# Altium schematic sheet IAQ_Schematic.schdoc
size 278 x 212 mm
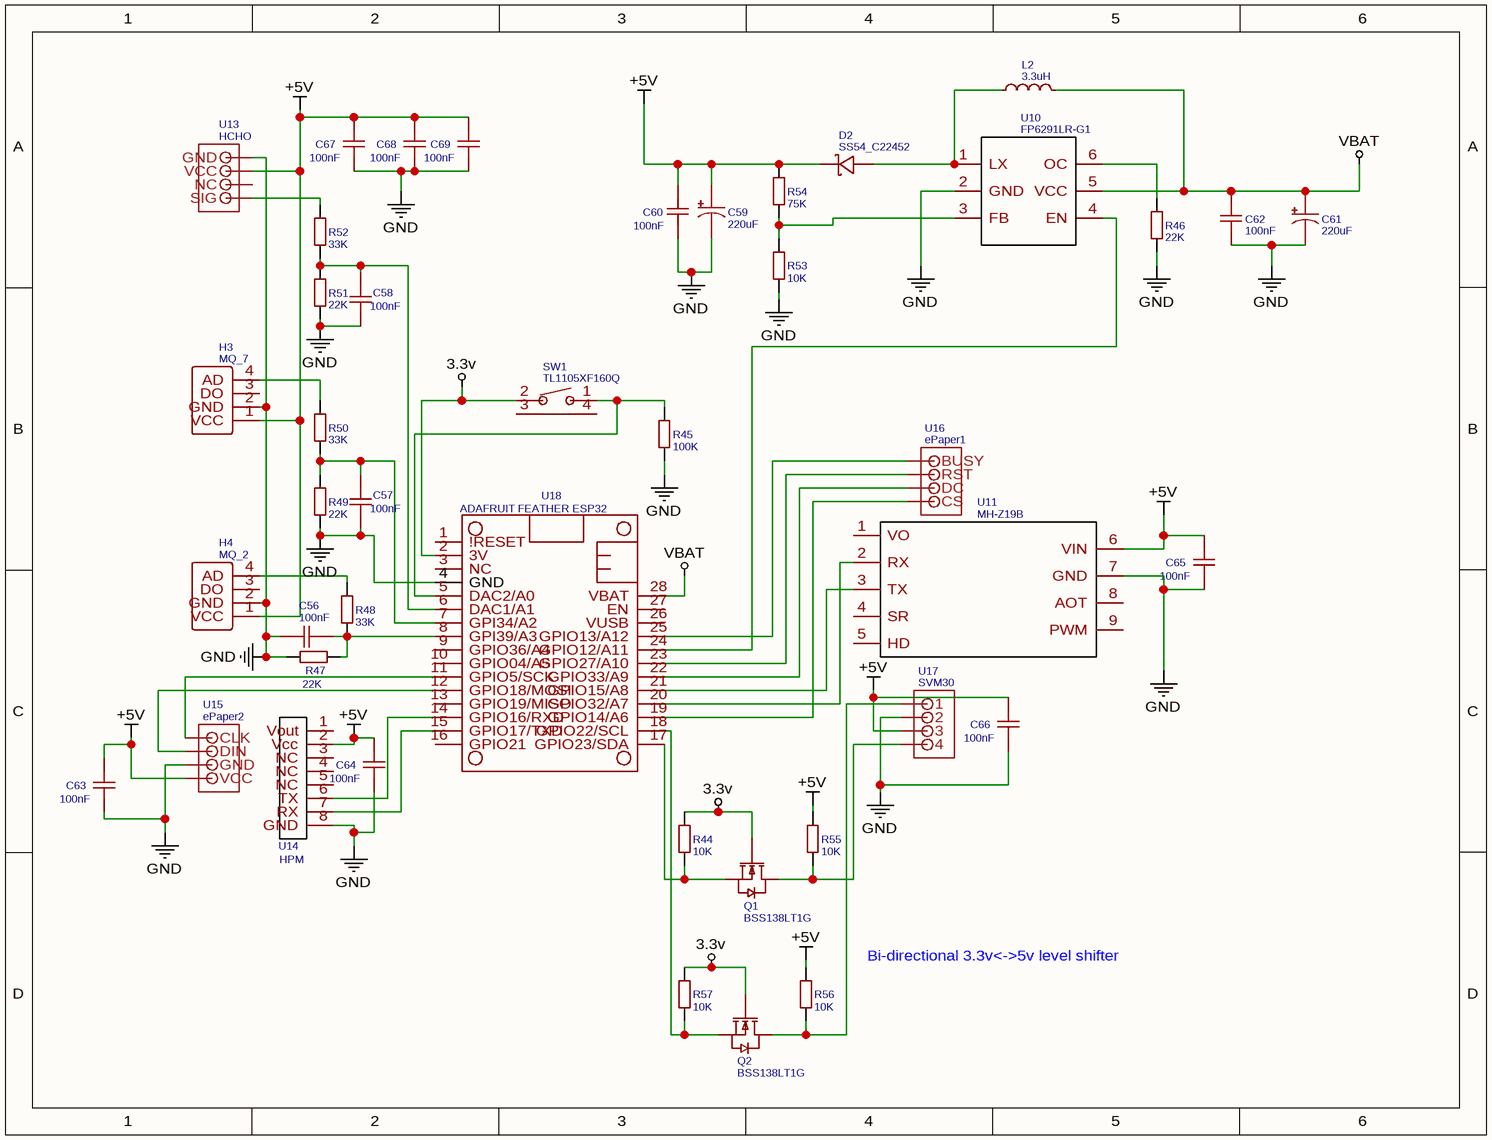
[diagram p0: IAQ_Schematic.schdoc]

## Parts
C56  100nF  [C0603]
C57  100nF  [C0603]
C58  100nF  [C0603]
C59  220uF  [CAP-SMD_BD10.0-L10.3-W10.3-FD]
C60  100nF  [C0603]
C61  220uF  [CAP-SMD_BD10.0-L10.3-W10.3-FD]
C62  100nF  [C0603]
C63  100nF  [C0603]
C64  100nF  [C0603]
C65  100nF  [C0603]
C66  100nF  [C0603]
C67  100nF  [C0603]
C68  100nF  [C0603]
C69  100nF  [C0603]
D2  SS54_C22452  [SMA_L4.3-W2.6-LS5.2-FD]
H3  MQ_7  [DIP-1X4P2.54]
H4  MQ_2  [DIP-1X4P2.54]
L2  3.3uH  [IND-SMD_L10.0-W9.0]
Q1  BSS138LT1G  [SOT-23-3_L2.9-W1.6-P1.90-LS2.8-BR]
Q2  BSS138LT1G  [SOT-23-3_L2.9-W1.6-P1.90-LS2.8-BR]
R44  10K  [R0603]
R45  100K  [R0603]
R46  22K  [R0603]
R47  22K  [R0603]
R48  33K  [R0603]
R49  22K  [R0603]
R50  33K  [R0603]
R51  22K  [R0603]
R52  33K  [R0603]
R53  10K  [R0603]
R54  75K  [R0603]
R55  10K  [R0603]
R56  10K  [R0603]
R57  10K  [R0603]
SW1  TL1105XF160Q  [KEY-TH_TL1105XF160Q]
U10  FP6291LR-G1  [SOT-23-6_L2.9-W1.6-P0.95-LS2.8-BL]
U11  MH-Z19B  [MH-Z19BCOR]
U13  HCHO  [JST_B4B-PH_HEADER]
U14  HPM  [1X8 1.25MM]
U15  ePaper2  [JST_B4B-PH_HEADER]
U16  ePaper1  [JST_B4B-PH_HEADER]
U17  SVM30  [JST_B4B-PH_HEADER]
U18  ADAFRUIT FEATHER ESP32  [ADAFRUIT FEATHER ESP32]

## Nets
3.3v: Q1.1(G) Q2.1(G) R44.2 R57.2 SW1.2 U18.2(3V)
+5V: C59.1 C60.2 C63.2 C64.2 C65.2 C66.2 C67.2 C68.2 C69.2 D2.2(K) H3.1(VCC) H4.1(VCC) R54.2 R55.2 R56.2 U11.6(VIN) U13.P3(VCC) U14.2(Vcc) U15.P4(VCC) U17.P3(3)
GND: C56.1 C57.1 C58.1 C59.2 C60.1 C61.2 C62.1 C63.1 C64.1 C65.1 C66.1 C67.1 C68.1 C69.1 H3.2(GND) H4.2(GND) R45.1 R46.1 R47.2 R49.1 R51.1 R53.1 U10.2(GND) U11.7(GND) U13.P4(GND) U14.8(GND) U15.P3(GND) U17.P2(2) U18.4(GND)
VBAT: C61.1 C62.2 L2.2 U10.5(VCC) U18.28(VBAT)
NetC56_2: C56.2 R47.1 R48.1 U18.8(GPI39/A3)
NetC57_2: C57.2 R49.2 R50.1 U18.7(GPI34/A2)
NetC58_2: C58.2 R51.2 R52.1 U18.6(DAC1/A1)
NetD2_1: D2.1(A) L2.1 U10.1(LX)
NetH3_4: H3.4(AD) R50.2
NetH4_4: H4.4(AD) R48.2
NetQ1_2: Q1.2(S) R44.1 U18.17(GPIO23/SDA)
NetQ1_3: Q1.3(D) R55.1 U17.P4(4)
NetQ2_2: Q2.2(S) R57.1 U18.18(GPIO22/SCL)
NetQ2_3: Q2.3(D) R56.1 U17.P1(1)
NetR45_2: R45.2 SW1.1 U18.5(DAC2/A0)
NetR46_2: R46.2 U10.6(OC)
NetR52_2: R52.2 U13.P1(SIG)
NetR53_2: R53.2 R54.1 U10.3(FB)
NetU10_4: U10.4(EN) U18.24(GPIO12/A11)
NetU11_2: U11.2(RX) U18.20(GPIO32/A7)
NetU11_3: U11.3(TX) U18.21(GPIO15/A8)
NetU14_6: U14.6(TX) U18.14(GPIO16/RXD)
NetU14_7: U14.7(RX) U18.15(GPIO17/TXD)
NetU15_P1: U15.P1(CLK) U18.11(GPIO5/SCK)
NetU15_P2: U15.P2(DIN) U18.12(GPIO18/MOSI)
NetU16_P1: U16.P1(BUSY) U18.25(GPIO13/A12)
NetU16_P2: U16.P2(RST) U18.23(GPIO27/A10)
NetU16_P3: U16.P3(DC) U18.22(GPIO33/A9)
NetU16_P4: U16.P4(CS) U18.19(GPIO14/A6)

Not connected (* = marked no-connect by the designer): H3 3(DO); H4 3(DO); SW1 3 4; U11 1(VO) 4(SR) 5(HD) 8(AOT) 9(PWM); U13 P2(NC); U14 1(Vout) 3(NC) 4(NC) 5(NC); U18 1(!RESET) 3(NC) 9(GPIO36/A4) 10(GPIO04/A5) 13(GPIO19/MISO) 16(GPIO21) 26(VUSB) 27(EN)

## Notes on the sheet
- Bi-directional 3.3v<->5v level shifter

## Library data of the parts
C56-C58 C60 C62-C69 = 100nF: BOM_Manufacturer: YAGEO; BOM_Manufacturer Part: CC0603KRX7R9BB104; nameAlias: Capacitance; SMT Type: Basic; BOM_Supplier: LCSC; BOM_LCSC Assembly: Yes; BOM_Supplier Part: C14663; spicePre: C; spiceSymbolName: CC0603KRX7R9BB104
C59 C61 = 220uF: BOM_Manufacturer: LELON; BOM_Manufacturer Part: VE-221M1HTR-1010; nameAlias: Capacitance; Contributor: LCSC; SMT Type: Extend; BOM_Supplier: LCSC; BOM_Supplier Part: C134732; BOM_LCSC Assembly: Yes; spicePre: C; spiceSymbolName: VE-221M1HTR-1010
D2 = SS54_C22452: BOM_Manufacturer Part: SS54; BOM_Manufacturer: MDD; SMT Type: Basic; BOM_Supplier: LCSC; BOM_LCSC Assembly: Yes; image: //image.lceda.cn/szlcsc/C22452.jpg; BOM_Supplier Part: C22452; spicePre: D; spiceSymbolName: SS54_C22452
H3 = MQ_7: BOM_Manufacturer: Ckmtw; BOM_Manufacturer Part: 220S-1*4P H=8.5MM Ytype Gold-plated; Contributor: LCSC; BOM_Supplier: LCSC; BOM_Supplier Part: C124413; spicePre: H; spiceSymbolName: 220S-1*4P H=8.5MM Ytype Gold-plated
H4 = MQ_2: BOM_Manufacturer: Ckmtw; BOM_Manufacturer Part: 220S-1*4P H=8.5MM Ytype Gold-plated; Contributor: LCSC; BOM_Supplier: LCSC; BOM_Supplier Part: C124413; spicePre: H; spiceSymbolName: 220S-1*4P H=8.5MM Ytype Gold-plated
L2 = 3.3uH: BOM_Manufacturer: ValuePro; BOM_Manufacturer Part: SM1054-3R3MT; nameAlias: Inductance; BOM_Supplier: LCSC; BOM_Supplier Part: C56605; spicePre: L; spiceSymbolName: SM1054-3R3MT
Q1 Q2 = BSS138LT1G: BOM_Manufacturer: ON; SMT Type: Extend; BOM_Supplier: LCSC; BOM_Manufacturer Part: BSS138LT1G; BOM_Supplier Part: C82045; BOM_LCSC Assembly: Yes; spicePre: Q; spiceSymbolName: BSS138LT1G
R44 R53 R55-R57 = 10K: BOM_Manufacturer: UniOhm; BOM_Manufacturer Part: 0603WAF1002T5E; nameAlias: Resistance (Ohms); SMT Type: Basic; BOM_Supplier: LCSC; BOM_LCSC Assembly: Yes; BOM_Supplier Part: C25804; spicePre: R; spiceSymbolName: 0603WAF1002T5E
R45 = 100K: BOM_Manufacturer: UniOhm; BOM_Manufacturer Part: 0603WAF1003T5E; nameAlias: Resistance (Ohms); SMT Type: Basic; BOM_Supplier: LCSC; BOM_LCSC Assembly: Yes; BOM_Supplier Part: C25803; spicePre: R; spiceSymbolName: 0603WAF1003T5E
R46 R47 R49 R51 = 22K: BOM_Manufacturer: UniOhm; BOM_Manufacturer Part: 0603WAF2202T5E; nameAlias: Resistance (Ohms); SMT Type: Basic; BOM_Supplier: LCSC; BOM_LCSC Assembly: Yes; BOM_Supplier Part: C31850; spicePre: R; spiceSymbolName: 0603WAF2202T5E
R48 R50 R52 = 33K: BOM_Manufacturer: UniOhm; BOM_Manufacturer Part: 0603WAF3302T5E; nameAlias: Resistance (Ohms); SMT Type: Basic; BOM_Supplier: LCSC; BOM_LCSC Assembly: Yes; BOM_Supplier Part: C4216; spicePre: R; spiceSymbolName: 0603WAF3302T5E
R54 = 75K: BOM_Manufacturer: UniOhm; BOM_Manufacturer Part: 0603WAF7502T5E; nameAlias: Resistance (Ohms); SMT Type: Basic; BOM_Supplier: LCSC; BOM_LCSC Assembly: Yes; BOM_Supplier Part: C23242; spicePre: R; spiceSymbolName: 0603WAF7502T5E
SW1 = TL1105XF160Q: BOM_Manufacturer: E-Switch; Contributor: LCSC; BOM_Supplier: LCSC; BOM_Supplier Part: C273492; BOM_Manufacturer Part: TL1105XF160Q; spicePre: S; spiceSymbolName: TL1105XF160Q
U10 = FP6291LR-G1: BOM_Manufacturer: Feeling Technology; SMT Type: Basic; BOM_Supplier: LCSC; BOM_Manufacturer Part: FP6291LR-G1; BOM_LCSC Assembly: Yes; image: //image.lceda.cn/szlcsc/C18701.jpg; BOM_Supplier Part: C18701; spicePre: U; spiceSymbolName: FP6291LR-G1
U11 = MH-Z19B: Contributor: Egor Avksentyev; spicePre: U; spiceSymbolName: MH-Z19B
U14 = HPM: BOM_Manufacturer Part: 0530470810; Contributor: CT_Engr; BOM_Supplier Part: WM1737-ND; BOM_Supplier: Digi-Key; spicePre: U; spiceSymbolName: CTE_Conn_1x8_1.25mm Molex PicoBlade
U18 = ADAFRUIT FEATHER ESP32: sourceId: 0S0UN5Zhz; timeStamp: 1457326346; spicePre: U; spiceSymbolName: ADAFRUIT FEATHER ESP32 CORRECT SIZE
U13 = HCHO: spicePre: U; spiceSymbolName: JST-PH_4-PIN_HEADER
U15 = ePaper2: spicePre: U; spiceSymbolName: JST-PH_4-PIN_HEADER
U16 = ePaper1: spicePre: U; spiceSymbolName: JST-PH_4-PIN_HEADER
U17 = SVM30: spicePre: U; spiceSymbolName: JST-PH_4-PIN_HEADER